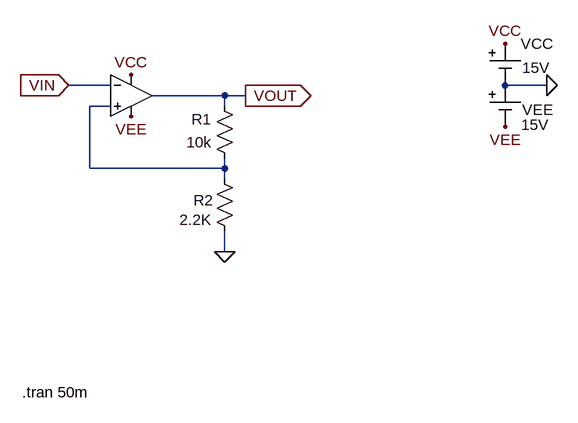
[diagram p0: schematic OpAmpTriggerSchmidt.asc]
OpAmpTriggerSchmidt.asc, the LTspice schematic file:
Version 4
SHEET 1 960 888
WIRE 208 352 144 352
WIRE 880 352 816 352
WIRE 384 368 272 368
WIRE 416 368 384 368
WIRE 208 384 176 384
WIRE 384 384 384 368
WIRE 176 480 176 384
WIRE 384 480 384 464
WIRE 384 480 176 480
WIRE 384 496 384 480
WIRE 384 608 384 576
FLAG 384 608 0
FLAG 416 368 VOUT
IOPIN 416 368 Out
FLAG 240 336 VCC
FLAG 240 400 VEE
FLAG 816 288 VCC
FLAG 816 416 VEE
FLAG 880 352 0
FLAG 144 352 VIN
IOPIN 144 352 In
SYMBOL Opamps/UniversalOpamp2 240 368 R0
WINDOW 0 16 -32 Invisible 2
SYMATTR InstName U1
SYMBOL res 400 480 R180
WINDOW 0 36 76 Left 2
WINDOW 3 36 40 Left 2
SYMATTR InstName R1
SYMATTR Value 10k
SYMBOL res 400 592 R180
WINDOW 0 33 63 Left 2
WINDOW 3 36 33 Left 2
SYMATTR InstName R2
SYMATTR Value 2.2K
SYMBOL Misc/cell 816 288 R0
WINDOW 3 26 37 Left 2
SYMATTR Value 15V
SYMATTR InstName VCC
SYMBOL Misc/cell 816 352 R0
WINDOW 0 26 38 Left 2
WINDOW 3 25 61 Left 2
SYMATTR InstName VEE
SYMATTR Value 15V
TEXT 72 824 Left 2 !.tran 50m

The netlist it stands for:
* OpAmpTriggerSchmidt.asc
XU1 N001 VIN VCC VEE VOUT level.2 Avol=1Meg GBW=10Meg Slew=10Meg ilimit=25m rail=0 Vos=0 phimargin=45 en=0 enk=0 in=0 ink=0 Rin=500Meg  ; pins IN+ IN- V+ V- OUT
R1 N001 VOUT 10k
R2 0 N001 2.2K
VCC VCC 0 15V
VEE 0 VEE 15V
.tran 50m
.lib UniversalOpamps2.sub
.backanno
.end